# Altium schematic sheet Gate Driver 2.SchDoc
size A3
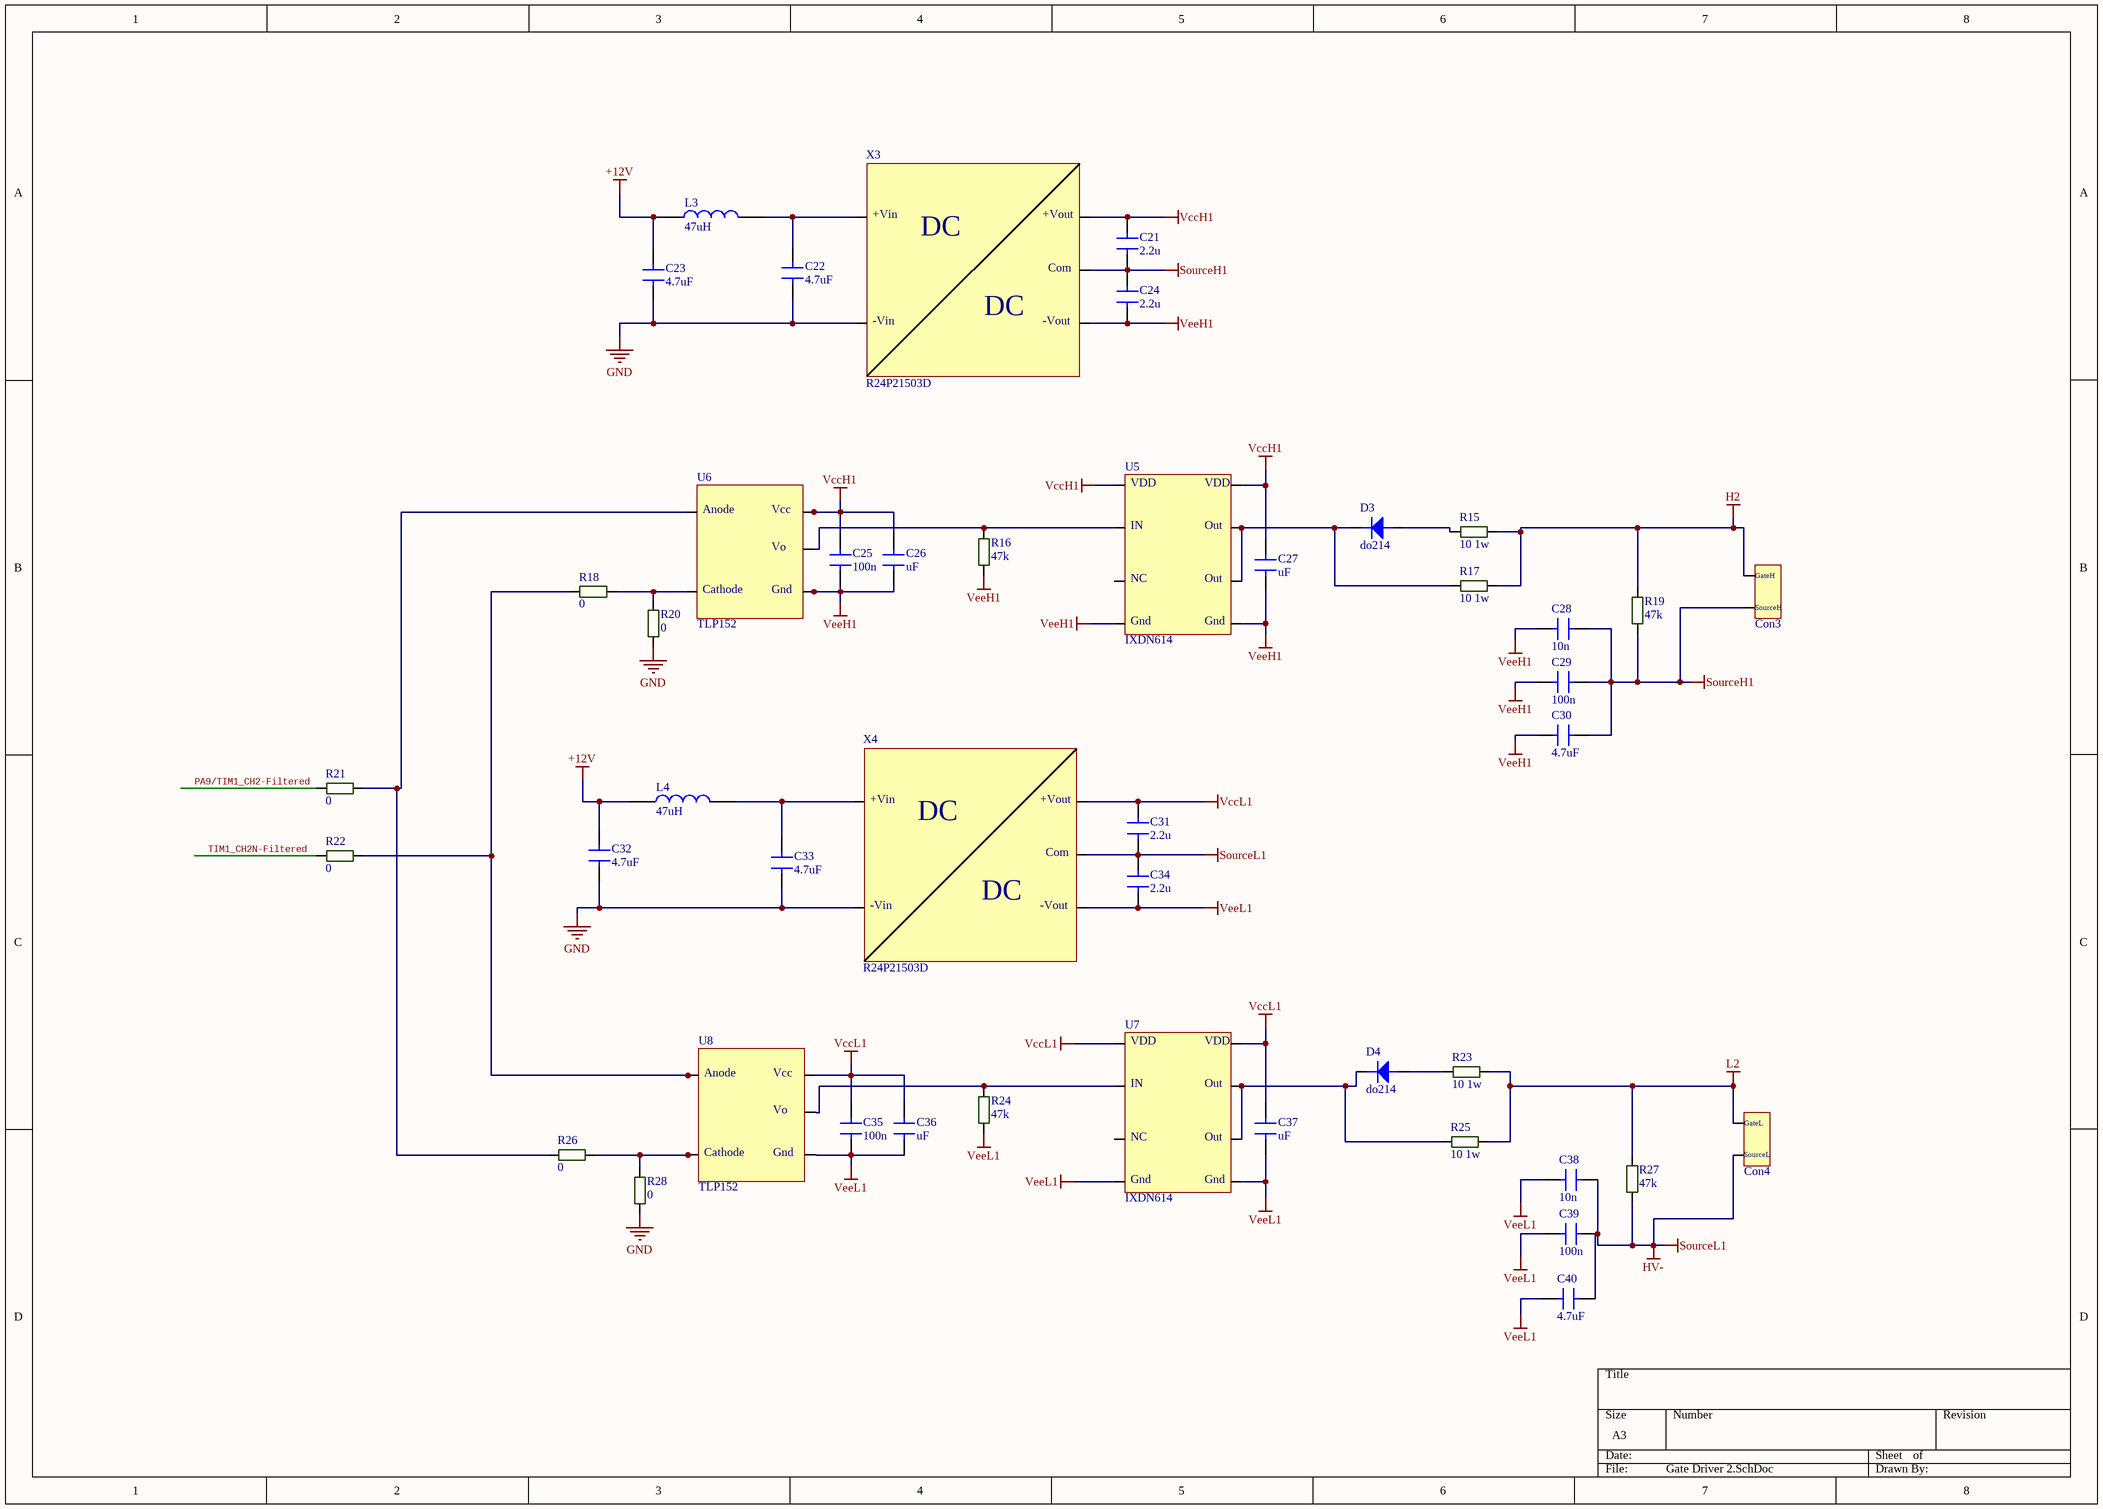
[diagram p0: Gate Driver 2.SchDoc]

## Parts
C21  2.2u  [C-0805]
C22  4.7uF  [C-1206]
C23  4.7uF  [C-1206]
C24  2.2u  [C-0805]
C25  100n  [C-0805]
C26  uF  [C-1206]
C27  uF  [C-1206]
C28  10n  [C-0805]
C29  100n  [C-0805]
C30  4.7uF  [C-1206]
C31  2.2u  [C-0805]
C32  4.7uF  [C-1206]
C33  4.7uF  [C-1206]
C34  2.2u  [C-0805]
C35  100n  [C-0805]
C36  uF  [C-1206]
C37  uF  [C-1206]
C38  10n  [C-0805]
C39  100n  [C-0805]
C40  4.7uF  [C-1206]
Con3  Connector2_1  [Conn]  (value not drawn)
Con4  Connector2_2  [Conn]  (value not drawn)
D3  do214  [DO-214AC]
D4  do214  [DO-214AC]
L3  47uH  [WE-TPC_282892]
L4  47uH  [WE-TPC_282892]
R15  10 1w  [R-2512]
R16  47k  [R-0805]
R17  10 1w  [R-2512]
R18  0  [R-0805]
R19  47k  [R-0805]
R20  0  [R-0805]
R21  0  [R-0805]
R22  0  [R-0805]
R23  10 1w  [R-2512]
R24  47k  [R-0805]
R25  10 1w  [R-2512]
R26  0  [R-0805]
R27  47k  [R-0805]
R28  0  [R-0805]
U5  IXDN614  [FAN3122 Soic8]
U6  TLP152  [TLP152]
U7  IXDN614  [FAN3122 Soic8]
U8  TLP152  [TLP152]
X3  R24P21503D  [SIP7]
X4  R24P21503D  [SIP7]

## Nets
+12V: C23.2 C32.2 L3.1 L4.1
GND: C22.1 C23.1 C32.1 C33.1 R20.1 R28.1 X3.2 X4.2
H2: Con3.1 R15.2 R17.2 R19.2
HV-: C31.1 C34.2 C38.1 C39.1 C40.2 Con4.2 R27.1 X4.6  [also labelled SourceL1]
L2: Con4.1 R23.2 R25.2 R27.2
SourceH1: C21.1 C24.2 C28.1 C29.1 C30.2 Con3.2 R19.1 X3.6
VccH1: C21.2 C25.2 C26.2 C27.2 U5.1 U5.8 U6.5 X3.7
VccL1: C31.2 C35.2 C36.2 C37.2 U7.1 U7.8 U8.5 X4.7
VeeH1: C24.1 C25.1 C26.1 C27.1 C28.2 C29.2 C30.1 R16.1 U5.4 U5.5 U6.3 X3.5
VeeL1: C34.1 C35.1 C36.1 C37.1 C38.2 C39.2 C40.1 R24.1 U7.4 U7.5 U8.3 X4.5
PA9/TIM1_CH2-Filtered: R21.1
TIM1_CH2N-Filtered: R22.1
NetC22_2: C22.2 L3.2 X3.1
NetC33_2: C33.2 L4.2 X4.1
NetD3_a: D3.a R15.1
NetD3_k: D3.k R17.1 U5.6 U5.7
NetD4_a: D4.a R23.1
NetD4_k: D4.k R25.1 U7.6 U7.7
NetR16_2: R16.2 U5.2 U6.4
NetR18_1: R18.1 R22.2 U8.1
NetR18_2: R18.2 R20.2 U6.2
NetR21_2: R21.2 R26.1 U6.1
NetR24_2: R24.2 U7.2 U8.4
NetR26_2: R26.2 R28.2 U8.2

Not connected (* = marked no-connect by the designer): U5 3; U7 3

## Notes on the sheet
- (in symbol Connector2_1) GateH; SourceH
- (in symbol Connector2_2) GateL; SourceL
- (in symbol IXDN614SITR) VDD; IN; Out; NC; Gnd
- (in symbol R24P21503D) +Vin; +Vout; DC; Com; -Vin; -Vout
- (in symbol TLP152(TPL,E) Anode; Vcc; Vo; Cathode; Gnd

## Library data of the parts
C21 C24 C25 C28 C29 C31 C34 C35 C38 C39 = C-0805
C22 C23 C30 C32 C33 C40 = Cap1206: MLCC (3216) 1206 4.7uF 50VDC ±10% X7R; Özdisan Part Number: CL31B475KBHNNNE; Manufacturer: SAMSUNG; Link: https://www.ozdisan.com/pasif-komponentler/kondansatorler/smd-kondansatorler-mlcc/CL31B475KBHNNNE; Price: 0,10407
C26 C27 C36 C37 = C-1206
D3 D4 = do214: DIODE FAST SWITCHING Single 150mA 75V SMT SOD323
L3 L4 = inductor
R15 R17 R23 R25 = R-2512
R16 = Res0805: RES.(2012) 0805 47K Ohms 5% 1/8W-S 100PPM; Manufacturer: ROYALOHM; Özdisan Part Number: 0805S8J0473T5E; Link: https://www.ozdisan.com/pasif-komponentler/direncler/smt-smd-direncler/0805S8J0473T5E; Price: 0,00234
R18 R20-R22 R26 R28 = Res0805: RES.(2012) 0805 0 Ohms 5% 1/8W-S 800PPM; Manufacturer: ROYALOHM; Özdisan Part Number: 0805S8J0000T5E; Price: 0,00234; Link: https://www.ozdisan.com/pasif-komponentler/direncler/smt-smd-direncler/0805S8J0000T5E
R19 R24 R27 = Res0805: RES.(2012) 0805 47K Ohms 5% 1/8W-S 100PPM; Özdisan Part Number: 0805S8J0473T5E; Manufacturer: ROYALOHM; Link: https://www.ozdisan.com/pasif-komponentler/direncler/smt-smd-direncler/0805S8J0473T5E; Price: 0,00234
U5 U7 = IXDN614SITR: 14A 8SOIC EXP MTL NON INVERTING; Manufacturer: Ixys Clare; Rise Time: 35ns; Propagation Delay: 70ns; Max Supply Voltage: 35V; Min Supply Voltage: 4.5V; Number of Outputs: 1; Fall Time: 25ns; ComponentLink1URL: https://datasheet.ciiva.com/6613/ixd-614-6613145.pdf?src-supplier=Digi-Key; ComponentLink1Description: https://datasheet.ciiva.com/6613/ixd-614-6613145.pdf?src-supplier=Digi-Key; Supplier 1: Mouser; Manufacturer Part Number: IXDN614SITR; RoHS: Yes; Pricing 1: 1 = 4.24000, 10 = 3.79000, 50 = 3.41000, 100 = 3.10000, 1000 = 2.12000, 10000 = 1.90000 (USD); Mount: Surface Mount; Case/Package: SOIC; Number of Pins: 8; Min Operating Temperature: -40°C; Max Operating Temperature: 125°C; Max Output Current: 14A; Packaging: Tape and Reel; Package Quantity: 2000; Number of Drivers: 1; Lead Free: Lead Free; Supplier Part Number 1: 849-IXDN614SITR
U6 U8 = TLP152(TPL,E: OPTOISO 3.75KV GATE DRIVER 6SO-5; Manufacturer: Toshiba; Number of Channels: 1; Propagation Delay: 165ns; Max Power Dissipation: 260mW; Direction: Unidirectional; Turn-On Delay Time: 190ns; Fall Time: 22ns; Forward Voltage: 1.57V; Output Current: 2.5A; Forward Current: 10mA; Rise Time: 18ns; High Level Output Current: 2A; Pulse Width Distortion (PWD): 50ns; ComponentLink1URL: https://datasheet.ciiva.com/41848/tlp152-datasheet-en-20120914-41848928.pdf?src-supplier=Digi-Key; ComponentLink1Description: https://datasheet.ciiva.com/41848/tlp152-datasheet-en-20120914-41848928.pdf?src-supplier=Digi-Key; Supplier 1: Mouser; Manufacturer Part Number: TLP152(TPL,E; RoHS: Yes; Stock 1: 22321; Pricing 1: 1 = 1.55000, 10 = 0.96800, 50 = 0.96800, 100 = 0.87200, 1000 = 0.54300, 10000 = 0.44000 (USD); Mount: Surface Mount; Case/Package: SO; Number of Pins: 5; Min Operating Temperature: -40°C; Max Operating Temperature: 100°C; Packaging: Tape and Reel; Package Quantity: 3000; Low Level Output Current: 2A; Max Output Current: 2.5A; Supplier Part Number 1: 757-TLP152TPLE
X3 X4 = R24P21503D: Manufacturer: Recom; Max Output Voltage: 15V; Supplier 1: Digi-Key; Manufacturer Part Number: R24P21503D; RoHS: No; Stock 1: 378; Pricing 1: 1 = 8.78000, 5 = 8.71200, 10 = 8.64500, 25 = 8.51200, 50 = 8.24600, 100 = 7.44800, 250 = 7.31500, 500 = 7.18200 (USD); Weight: 4.3g; Length: 19.5mm; Height: 12.5mm; Width: 9.8mm; Supplier Part Number 1: 945-3071-5-ND
Con3 = Connector2_1: System: Connector
Con4 = Connector2_2: System: Connector